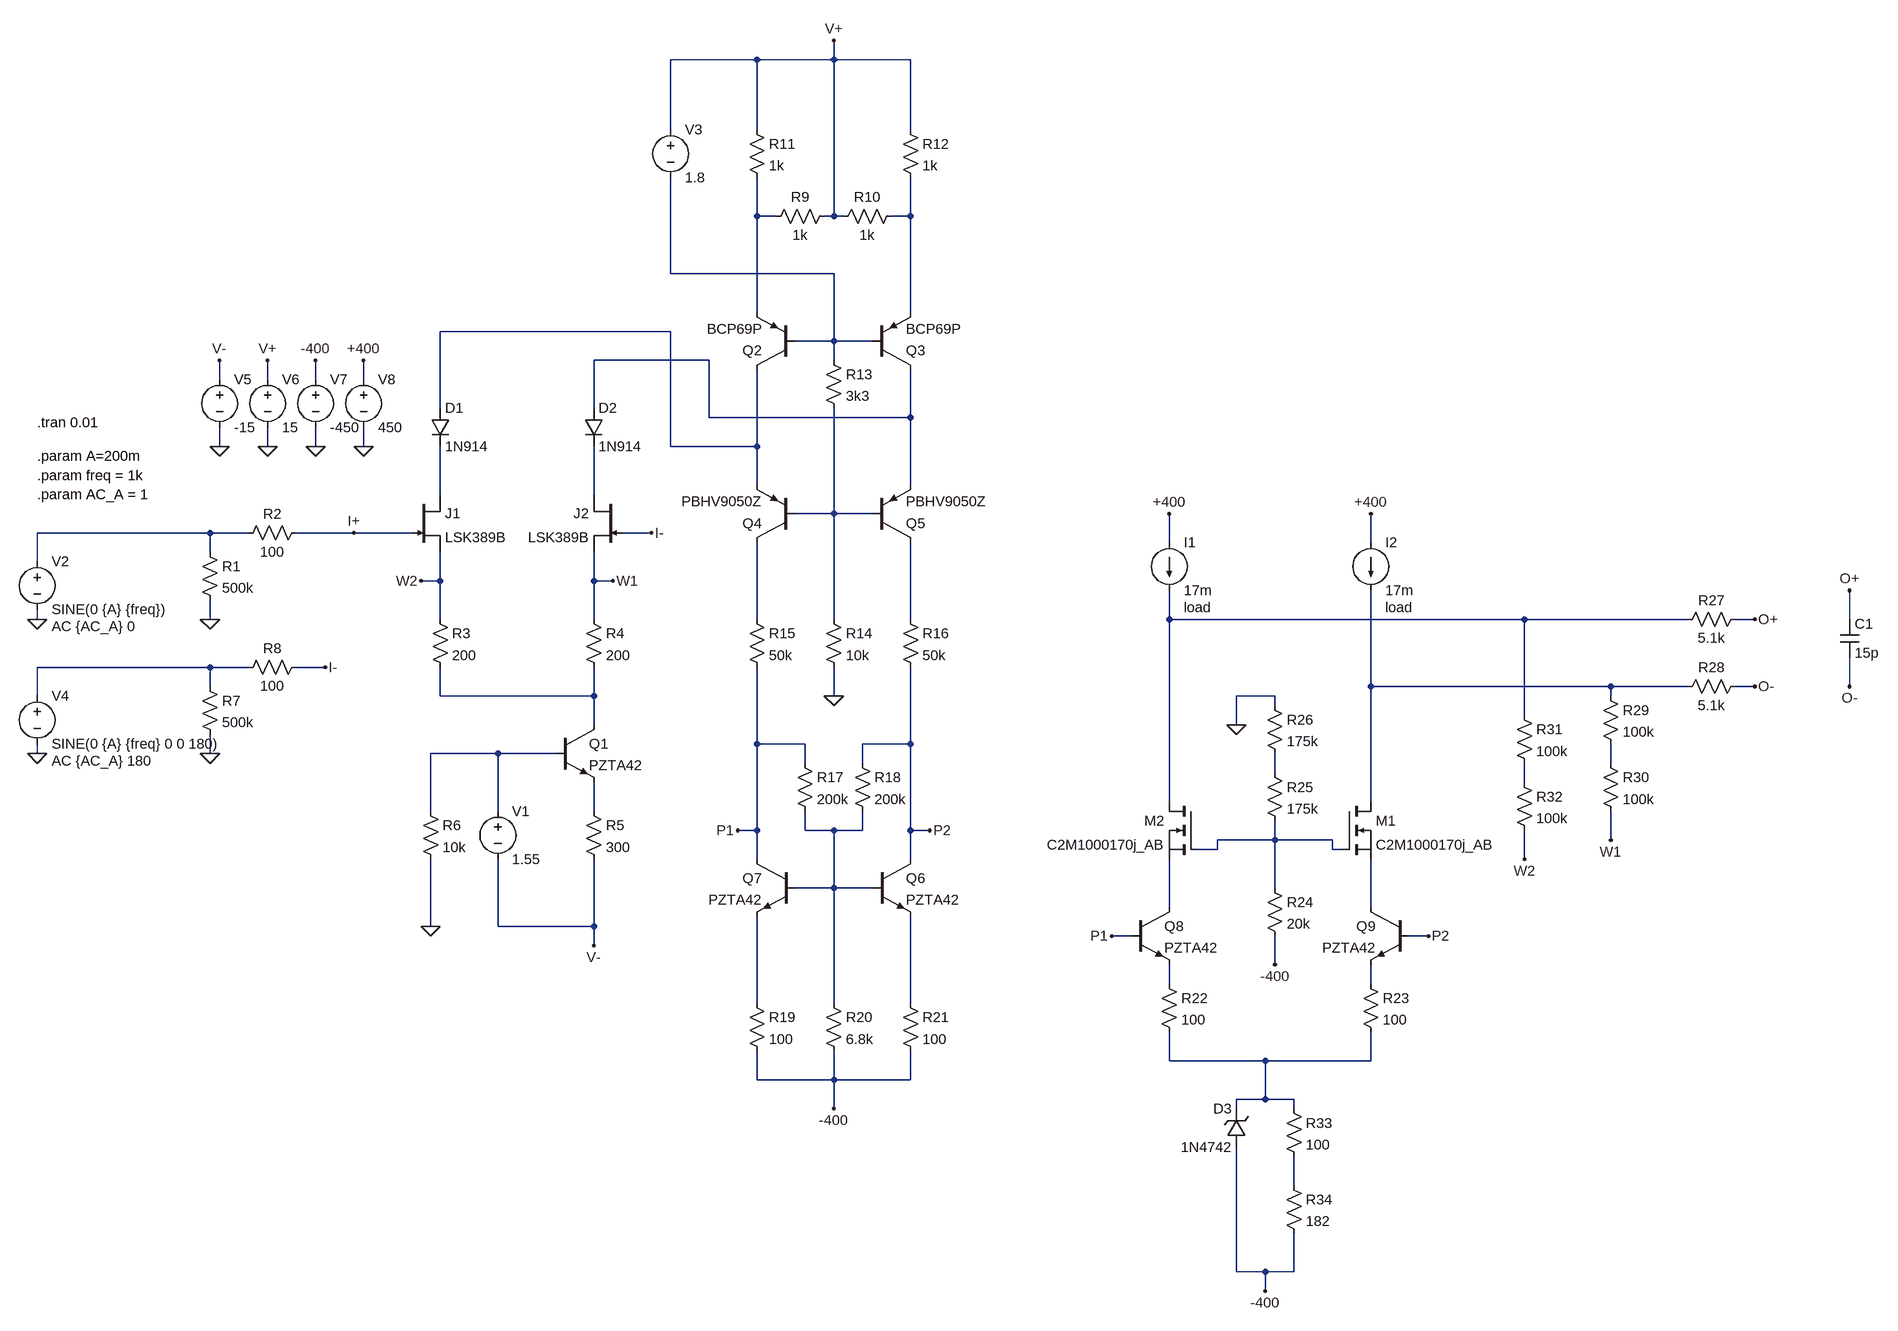
[diagram p0: schematic carbon.asc]
carbon.asc, the LTspice schematic file:
Version 4
SHEET 1 2872 1428
WIRE 816 -752 672 -752
WIRE 944 -752 944 -784
WIRE 944 -752 816 -752
WIRE 1072 -752 944 -752
WIRE 672 -608 672 -752
WIRE 816 -608 816 -752
WIRE 1072 -608 1072 -752
WIRE 816 -464 816 -528
WIRE 848 -464 816 -464
WIRE 944 -464 944 -752
WIRE 944 -464 928 -464
WIRE 960 -464 944 -464
WIRE 1072 -464 1072 -528
WIRE 1072 -464 1040 -464
WIRE 672 -368 672 -528
WIRE 944 -368 672 -368
WIRE 816 -304 816 -464
WIRE 1072 -304 1072 -464
WIRE 672 -272 288 -272
WIRE 944 -256 944 -368
WIRE 944 -256 880 -256
WIRE 1008 -256 944 -256
WIRE 736 -224 544 -224
WIRE 944 -224 944 -256
WIRE -80 -192 -80 -224
WIRE 0 -192 0 -224
WIRE 80 -192 80 -224
WIRE 160 -192 160 -224
WIRE 288 -144 288 -272
WIRE 544 -144 544 -224
WIRE 736 -128 736 -224
WIRE 1072 -128 1072 -208
WIRE 1072 -128 736 -128
WIRE -80 -80 -80 -112
WIRE 0 -80 0 -112
WIRE 80 -80 80 -112
WIRE 160 -80 160 -112
WIRE 672 -80 672 -272
WIRE 816 -80 816 -208
WIRE 816 -80 672 -80
WIRE 816 -16 816 -80
WIRE 1072 -16 1072 -128
WIRE 288 0 288 -80
WIRE 544 0 544 -80
WIRE 944 32 944 -144
WIRE 944 32 880 32
WIRE 1008 32 944 32
WIRE -96 64 -384 64
WIRE -32 64 -96 64
WIRE 144 64 48 64
WIRE 240 64 144 64
WIRE 640 64 592 64
WIRE 1600 80 1600 32
WIRE 1936 80 1936 32
WIRE -96 96 -96 64
WIRE -384 112 -384 64
WIRE 288 144 288 96
WIRE 288 144 256 144
WIRE 544 144 544 96
WIRE 576 144 544 144
WIRE -384 208 -384 192
WIRE -96 208 -96 176
WIRE 288 208 288 144
WIRE 544 208 544 144
WIRE 816 208 816 80
WIRE 944 208 944 32
WIRE 1072 208 1072 80
WIRE 1600 208 1600 160
WIRE 2192 208 1600 208
WIRE 2464 208 2192 208
WIRE 2576 208 2544 208
WIRE 2816 208 2816 160
WIRE -96 288 -384 288
WIRE -32 288 -96 288
WIRE 96 288 48 288
WIRE -96 320 -96 288
WIRE 1936 320 1936 160
WIRE 2336 320 1936 320
WIRE 2464 320 2336 320
WIRE 2576 320 2544 320
WIRE 2816 320 2816 272
WIRE -384 336 -384 288
WIRE 288 336 288 288
WIRE 544 336 544 288
WIRE 544 336 288 336
WIRE 944 336 944 288
WIRE 1776 336 1712 336
WIRE 2336 336 2336 320
WIRE 1776 352 1776 336
WIRE 2192 368 2192 208
WIRE 544 384 544 336
WIRE 1712 384 1712 336
WIRE 816 416 816 288
WIRE 896 416 816 416
WIRE 1072 416 1072 288
WIRE 1072 416 992 416
WIRE -384 432 -384 416
WIRE -96 432 -96 400
WIRE 384 432 272 432
WIRE 480 432 384 432
WIRE 896 448 896 416
WIRE 992 448 992 416
WIRE 2336 448 2336 416
WIRE 1776 464 1776 432
WIRE 2192 480 2192 448
WIRE 1600 512 1600 208
WIRE 1936 512 1936 320
WIRE 272 528 272 432
WIRE 384 528 384 432
WIRE 544 528 544 480
WIRE 816 560 816 416
WIRE 816 560 784 560
WIRE 896 560 896 528
WIRE 944 560 896 560
WIRE 992 560 992 528
WIRE 992 560 944 560
WIRE 1072 560 1072 416
WIRE 1104 560 1072 560
WIRE 1776 576 1776 544
WIRE 1776 576 1680 576
WIRE 1872 576 1776 576
WIRE 2336 576 2336 528
WIRE 1680 592 1680 576
WIRE 1680 592 1648 592
WIRE 1872 592 1872 576
WIRE 1888 592 1872 592
WIRE 816 608 816 560
WIRE 1072 608 1072 560
WIRE 2192 608 2192 560
WIRE 944 656 944 560
WIRE 944 656 880 656
WIRE 1008 656 944 656
WIRE 1776 656 1776 576
WIRE 1600 688 1600 608
WIRE 1936 688 1936 608
WIRE 272 720 272 608
WIRE 384 720 384 608
WIRE 544 720 544 608
WIRE 544 720 384 720
WIRE 1536 736 1504 736
WIRE 2032 736 2000 736
WIRE 544 752 544 720
WIRE 1776 784 1776 736
WIRE 1600 816 1600 784
WIRE 1936 816 1936 784
WIRE 816 848 816 704
WIRE 944 848 944 656
WIRE 1072 848 1072 704
WIRE 1600 944 1600 896
WIRE 1760 944 1600 944
WIRE 1936 944 1936 896
WIRE 1936 944 1760 944
WIRE 816 976 816 928
WIRE 944 976 944 928
WIRE 944 976 816 976
WIRE 1072 976 1072 928
WIRE 1072 976 944 976
WIRE 1760 1008 1760 944
WIRE 1760 1008 1712 1008
WIRE 1808 1008 1760 1008
WIRE 944 1024 944 976
WIRE 1712 1024 1712 1008
WIRE 1808 1024 1808 1008
WIRE 1808 1152 1808 1104
WIRE 1712 1296 1712 1088
WIRE 1760 1296 1712 1296
WIRE 1808 1296 1808 1232
WIRE 1808 1296 1760 1296
WIRE 1760 1328 1760 1296
FLAG -96 208 0
FLAG 544 752 V-
FLAG 272 720 0
FLAG 640 64 I-
FLAG 144 64 I+
FLAG -96 432 0
FLAG 96 288 I-
FLAG -384 208 0
FLAG 944 336 0
FLAG 944 1024 -400
FLAG 576 144 W1
FLAG 256 144 W2
FLAG -80 -80 0
FLAG 0 -80 0
FLAG 80 -80 0
FLAG 160 -80 0
FLAG 80 -224 -400
FLAG 160 -224 +400
FLAG 0 -224 V+
FLAG -80 -224 V-
FLAG 944 -784 V+
FLAG -384 432 0
FLAG 1776 784 -400
FLAG 1712 384 0
FLAG 1504 736 P1
FLAG 784 560 P1
FLAG 1104 560 P2
FLAG 2032 736 P2
FLAG 2816 160 O+
FLAG 2816 320 O-
FLAG 2192 608 W2
FLAG 2336 576 W1
FLAG 1760 1328 -400
FLAG 1600 32 +400
FLAG 1936 32 +400
FLAG 2576 208 O+
FLAG 2576 320 O-
SYMBOL res -112 80 R0
SYMATTR InstName R1
SYMATTR Value 500k
SYMBOL res 64 48 R90
WINDOW 0 0 56 VBottom 2
WINDOW 3 32 56 VTop 2
SYMATTR InstName R2
SYMATTR Value 100
SYMBOL njf 240 0 R0
SYMATTR InstName J1
SYMATTR Value LSK389B
SYMBOL diode 272 -144 R0
SYMATTR InstName D1
SYMATTR Value 1N914
SYMBOL res 272 192 R0
SYMATTR InstName R3
SYMATTR Value 200
SYMBOL res 528 192 R0
SYMATTR InstName R4
SYMATTR Value 200
SYMBOL npn 480 384 R0
SYMATTR InstName Q1
SYMATTR Value PZTA42
SYMBOL voltage 384 512 R0
WINDOW 123 0 0 Left 0
WINDOW 39 0 0 Left 0
SYMATTR InstName V1
SYMATTR Value 1.55
SYMBOL res 528 512 R0
SYMATTR InstName R5
SYMATTR Value 300
SYMBOL res 256 512 R0
SYMATTR InstName R6
SYMATTR Value 10k
SYMBOL res -112 304 R0
SYMATTR InstName R7
SYMATTR Value 500k
SYMBOL res 64 272 R90
WINDOW 0 0 56 VBottom 2
WINDOW 3 32 56 VTop 2
SYMATTR InstName R8
SYMATTR Value 100
SYMBOL voltage -384 96 R0
WINDOW 123 24 124 Left 2
WINDOW 39 0 0 Left 0
SYMATTR Value2 AC {AC_A} 0
SYMATTR InstName V2
SYMATTR Value SINE(0 {A} {freq})
SYMBOL pnp 880 -208 R180
SYMATTR InstName Q2
SYMATTR Value BCP69P
SYMBOL res 944 -480 R90
WINDOW 0 0 56 VBottom 2
WINDOW 3 32 56 VTop 2
SYMATTR InstName R9
SYMATTR Value 1k
SYMBOL res 1056 -480 R90
WINDOW 0 0 56 VBottom 2
WINDOW 3 32 56 VTop 2
SYMATTR InstName R10
SYMATTR Value 1k
SYMBOL res 800 -624 R0
SYMATTR InstName R11
SYMATTR Value 1k
SYMBOL res 1056 -624 R0
SYMATTR InstName R12
SYMATTR Value 1k
SYMBOL voltage 672 -624 R0
WINDOW 123 0 0 Left 0
WINDOW 39 0 0 Left 0
SYMATTR InstName V3
SYMATTR Value 1.8
SYMBOL res 928 -240 R0
SYMATTR InstName R13
SYMATTR Value 3k3
SYMBOL pnp 880 80 R180
SYMATTR InstName Q4
SYMATTR Value PBHV9050Z
SYMBOL res 928 192 R0
SYMATTR InstName R14
SYMATTR Value 10k
SYMBOL res 800 192 R0
SYMATTR InstName R15
SYMATTR Value 50k
SYMBOL res 1056 192 R0
SYMATTR InstName R16
SYMATTR Value 50k
SYMBOL res 880 432 R0
SYMATTR InstName R17
SYMATTR Value 200k
SYMBOL res 976 432 R0
SYMATTR InstName R18
SYMATTR Value 200k
SYMBOL res 800 832 R0
SYMATTR InstName R19
SYMATTR Value 100
SYMBOL res 928 832 R0
SYMATTR InstName R20
SYMATTR Value 6.8k
SYMBOL res 1056 832 R0
SYMATTR InstName R21
SYMATTR Value 100
SYMBOL voltage -80 -208 R0
WINDOW 123 0 0 Left 0
WINDOW 39 0 0 Left 0
SYMATTR InstName V5
SYMATTR Value -15
SYMBOL voltage 0 -208 R0
WINDOW 123 0 0 Left 0
WINDOW 39 0 0 Left 0
SYMATTR InstName V6
SYMATTR Value 15
SYMBOL voltage 80 -208 R0
WINDOW 123 0 0 Left 0
WINDOW 39 0 0 Left 0
SYMATTR InstName V7
SYMATTR Value -450
SYMBOL voltage 160 -208 R0
WINDOW 123 0 0 Left 0
WINDOW 39 0 0 Left 0
SYMATTR InstName V8
SYMATTR Value 450
SYMBOL njf 592 0 M0
SYMATTR InstName J2
SYMATTR Value LSK389B
SYMBOL diode 528 -144 R0
SYMATTR InstName D2
SYMATTR Value 1N914
SYMBOL pnp 1008 -208 M180
SYMATTR InstName Q3
SYMATTR Value BCP69P
SYMBOL pnp 1008 80 M180
SYMATTR InstName Q5
SYMATTR Value PBHV9050Z
SYMBOL npn 1008 608 R0
SYMATTR InstName Q6
SYMATTR Value PZTA42
SYMBOL npn 880 608 M0
SYMATTR InstName Q7
SYMATTR Value PZTA42
SYMBOL voltage -384 320 R0
WINDOW 123 24 124 Left 2
WINDOW 39 0 0 Left 0
SYMATTR Value2 AC {AC_A} 180
SYMATTR InstName V4
SYMATTR Value SINE(0 {A} {freq} 0 0 180)
SYMBOL npn 1536 688 R0
SYMATTR InstName Q8
SYMATTR Value PZTA42
SYMBOL npn 2000 688 M0
SYMATTR InstName Q9
SYMATTR Value PZTA42
SYMBOL res 1584 800 R0
SYMATTR InstName R22
SYMATTR Value 100
SYMBOL res 1920 800 R0
SYMATTR InstName R23
SYMATTR Value 100
SYMBOL nmos 1888 512 R0
SYMATTR InstName M1
SYMATTR Value C2M1000170j_AB
SYMBOL nmos 1648 512 M0
SYMATTR InstName M2
SYMATTR Value C2M1000170j_AB
SYMBOL res 1760 640 R0
SYMATTR InstName R24
SYMATTR Value 20k
SYMBOL res 1760 448 R0
SYMATTR InstName R25
SYMATTR Value 175k
SYMBOL res 1760 336 R0
SYMATTR InstName R26
SYMATTR Value 175k
SYMBOL current 1600 80 R0
WINDOW 123 0 0 Left 0
WINDOW 39 24 108 Left 2
SYMATTR SpiceLine load
SYMATTR InstName I1
SYMATTR Value 17m
SYMBOL res 2560 192 R90
WINDOW 0 0 56 VBottom 2
WINDOW 3 32 56 VTop 2
SYMATTR InstName R27
SYMATTR Value 5.1k
SYMBOL res 2560 304 R90
WINDOW 0 0 56 VBottom 2
WINDOW 3 32 56 VTop 2
SYMATTR InstName R28
SYMATTR Value 5.1k
SYMBOL res 2320 320 R0
SYMATTR InstName R29
SYMATTR Value 100k
SYMBOL res 2320 432 R0
SYMATTR InstName R30
SYMATTR Value 100k
SYMBOL res 2176 352 R0
SYMATTR InstName R31
SYMATTR Value 100k
SYMBOL res 2176 464 R0
SYMATTR InstName R32
SYMATTR Value 100k
SYMBOL zener 1728 1088 R180
WINDOW 0 24 64 Left 2
WINDOW 3 24 0 Left 2
SYMATTR InstName D3
SYMATTR Value 1N4742
SYMATTR Description Diode
SYMATTR Type diode
SYMBOL res 1792 1008 R0
SYMATTR InstName R33
SYMATTR Value 100
SYMBOL res 1792 1136 R0
SYMATTR InstName R34
SYMATTR Value 182
SYMBOL current 1936 80 R0
WINDOW 123 0 0 Left 0
WINDOW 39 24 108 Left 2
SYMATTR SpiceLine load
SYMATTR InstName I2
SYMATTR Value 17m
SYMBOL cap 2800 208 R0
SYMATTR InstName C1
SYMATTR Value 15p
TEXT -384 -120 Left 2 !.tran 0.01
TEXT -384 -64 Left 2 !.param A=200m
TEXT -384 -32 Left 2 !.param freq = 1k
TEXT -384 0 Left 2 !.param AC_A = 1

The netlist it stands for:
* carbon.asc
R1 N009 0 500k
R2 I+ N009 100
J1 N006 I+ W2 LSK389B
D1 N004 N006 1N914
R3 W2 N015 200
R4 W1 N015 200
Q1 N015 N016 N020 0 PZTA42
V1 N016 V- 1.55
R5 N020 V- 300
R6 N016 0 10k
R7 N013 0 500k
R8 I- N013 100
V2 N009 0 SINE(0 {A} {freq}) AC {AC_A} 0
Q2 N004 N003 N001 0 BCP69P
R9 V+ N001 1k
R10 N002 V+ 1k
R11 V+ N001 1k
R12 V+ N002 1k
V3 V+ N003 1.8
R13 N003 N008 3k3
Q4 N010 N008 N004 0 PBHV9050Z
R14 N008 0 10k
R15 N010 P1 50k
R16 N011 P2 50k
R17 P1 N021 200k
R18 P2 N021 200k
R19 N027 -400 100
R20 N021 -400 6.8k
R21 N028 -400 100
V5 V- 0 -15
V6 V+ 0 15
V7 -400 0 -450
V8 +400 0 450
J2 N007 I- W1 LSK389B
D2 N005 N007 1N914
Q3 N005 N003 N002 0 BCP69P
Q5 N011 N008 N005 0 PBHV9050Z
Q6 P2 N021 N028 0 PZTA42
Q7 P1 N021 N027 0 PZTA42
V4 N013 0 SINE(0 {A} {freq} 0 0 180) AC {AC_A} 180
Q8 N023 P1 N025 0 PZTA42
Q9 N024 P2 N026 0 PZTA42
R22 N025 N029 100
R23 N026 N029 100
M1 N014 N022 N024 N024 C2M1000170j_AB
M2 N012 N022 N023 N023 C2M1000170j_AB
R24 N022 -400 20k
R25 N018 N022 175k
R26 0 N018 175k
I1 +400 N012 17m load
R27 O+ N012 5.1k
R28 O- N014 5.1k
R29 N014 N017 100k
R30 N017 W1 100k
R31 N012 N019 100k
R32 N019 W2 100k
D3 -400 N029 1N4742
R33 N029 N030 100
R34 N030 -400 182
I2 +400 N014 17m load
C1 O+ O- 15p
.model D D
.lib standard.dio
.model NPN NPN
.model PNP PNP
.lib standard.bjt
.model NJF NJF
.model PJF PJF
.lib standard.jft
.model NMOS NMOS
.model PMOS PMOS
.lib standard.mos
.tran 0.01
.param A=200m
.param freq = 1k
.param AC_A = 1
.backanno
.end